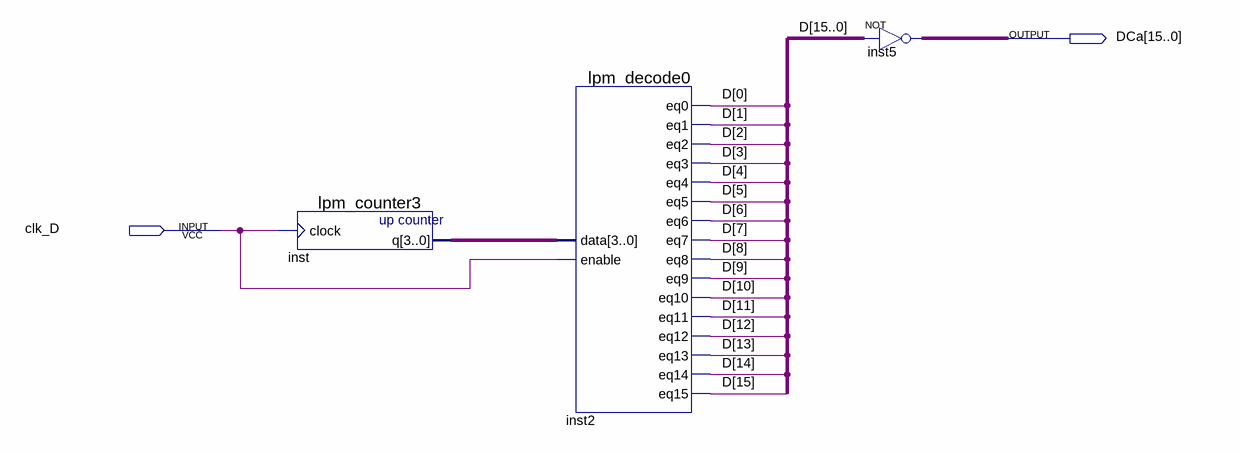
[diagram p0: schematic sheet]
// Quartus schematic block3.bdf as structural Verilog: 3 symbols, 2 pins
module block3 (
  input  clk_D,
  output [15:0] DCa
);

  wire [3:0] inst_q;
  wire [15:0] D;

  lpm_counter3 inst (.clock(clk_D), .q(inst_q));
  lpm_decode0 inst2 (
    .data(inst_q), .enable(clk_D), .eq0(D[0]), .eq1(D[1]), .eq2(D[2]), .eq3(D[3]), .eq4(D[4]), .eq5(D[5]),
    .eq6(D[6]), .eq7(D[7]), .eq8(D[8]), .eq9(D[9]), .eq10(D[10]), .eq11(D[11]), .eq12(D[12]), .eq13(D[13]),
    .eq14(D[14]), .eq15(D[15]));
  assign DCa = ~D;  // NOT inst5, 16 bits wide
endmodule
